# Altium project CAN_CurrentLoopModule.PrjPcb
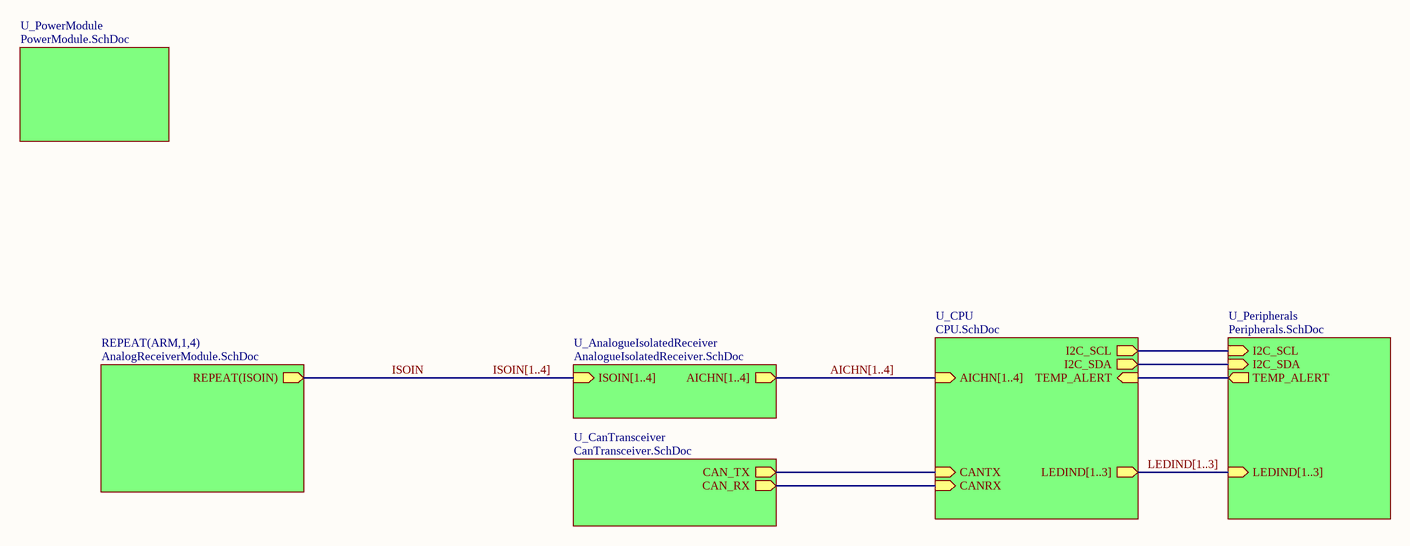
[diagram p0: TopSheet.SchDoc]
Address_Website: pablintino.com; EMail: me@pablintino.com; Project: AIC-ISO-C Module; VersionRevision: 1
7 sheets, 165 parts. Net scope: hierarchical (ports join the sheet entries above them; power ports are global).
Board file: AnalogIO-CAN-HW-Rev1.PcbDoc
Sheets:
  TopSheet.SchDoc
    U_PowerModule = PowerModule.SchDoc
    U_AnalogueIsolatedReceiver = AnalogueIsolatedReceiver.SchDoc
    U_CanTransceiver = CanTransceiver.SchDoc
    U_CPU = CPU.SchDoc
    U_Peripherals = Peripherals.SchDoc
    ARM1 = AnalogReceiverModule.SchDoc
    ARM2 = AnalogReceiverModule.SchDoc
    ARM3 = AnalogReceiverModule.SchDoc
    ARM4 = AnalogReceiverModule.SchDoc

## Sheet TopSheet.SchDoc
size A4

### Sub-sheets
REPEAT(ARM,1,4) = AnalogReceiverModule.SchDoc: REPEAT(ISOIN) (out)
U_AnalogueIsolatedReceiver = AnalogueIsolatedReceiver.SchDoc: ISOIN[1..4] (in), AICHN[1..4] (out)
U_CanTransceiver = CanTransceiver.SchDoc: CAN_RX (out), CAN_TX (out)
U_CPU = CPU.SchDoc: CANTX (in), CANRX (in), AICHN[1..4] (in), I2C_SCL (out), I2C_SDA (out), TEMP_ALERT (in), LEDIND[1..3] (out)
U_Peripherals = Peripherals.SchDoc: I2C_SCL (in), TEMP_ALERT (out), I2C_SDA (in), LEDIND[1..3] (in)
U_PowerModule = PowerModule.SchDoc: no entries

### Nets
CAN_RXD: sheet U_CanTransceiver/CAN_RX, sheet U_CPU/CANRX
CAN_TXD: sheet U_CanTransceiver/CAN_TX, sheet U_CPU/CANTX
I2C_SCL: sheet U_CPU/I2C_SCL, sheet U_Peripherals/I2C_SCL
I2C_SDA: sheet U_CPU/I2C_SDA, sheet U_Peripherals/I2C_SDA
ISOIN: sheet REPEAT(ARM,1,4)/REPEAT(ISOIN)
NetR23_2: sheet U_CPU/TEMP_ALERT, sheet U_Peripherals/TEMP_ALERT

### Buses and harness runs
bus AICHN[1..4] = sheet U_AnalogueIsolatedReceiver/AICHN[1..4] = sheet U_CPU/AICHN[1..4]
bus ISOIN[1..4] = sheet U_AnalogueIsolatedReceiver/ISOIN[1..4]
bus LEDIND[1..3] = sheet U_CPU/LEDIND[1..3] = sheet U_Peripherals/LEDIND[1..3]

### Notes on the sheet
- Title:
- Drawn By:
- Page Contents:
- Checked By:
- Size:
- Date:
- File:
- License:
- Email:
- A4
- Number:
- Time:
- Revision:
- Sheet
- Website:
- of

## Sheet PowerModule.SchDoc: CAN Current Loop Module - Power
size A4; Author: Pablo R Nava; DrawnBy: Pablo R Nava; Engineer: Pablo R Nava
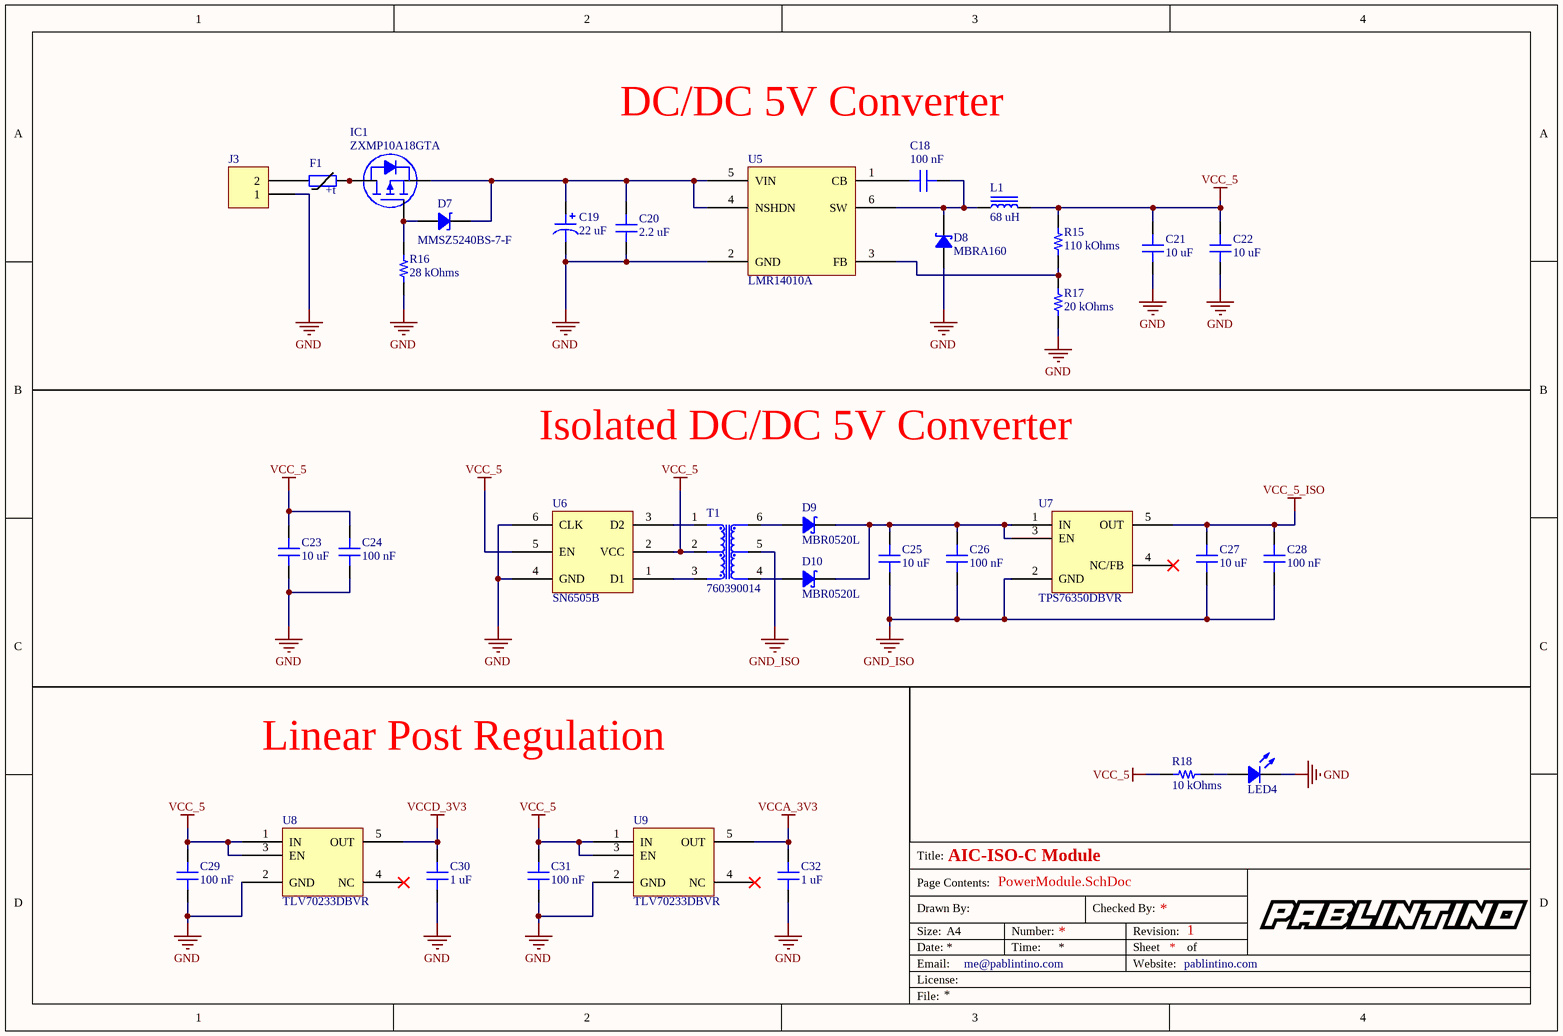
[diagram p1: PowerModule.SchDoc]

### Parts
C18  100 nF  [CAP 0805_2012]
C19  22 uF  [CAP ALSMD 6.3MM H7.7MM]
C20  2.2 uF  [CAP 1206_3216 - 1.8MM]
C21  10 uF  [CAP 1206_3216 - 1.8MM]
C22  10 uF  [CAP 1206_3216 - 1.8MM]
C23  10 uF  [CAP 0805_2012]
C24  100 nF  [CAP 0805_2012]
C25  10 uF  [CAP 0805_2012]
C26  100 nF  [CAP 0805_2012]
C27  10 uF  [CAP 0805_2012]
C28  100 nF  [CAP 0603_1608]
C29  100 nF  [CAP 0603_1608]
C30  1 uF  [CAP 0805_2012]
C31  100 nF  [CAP 0603_1608]
C32  1 uF  [CAP 0805_2012]
D7  MMSZ5240BS-7-F  [SOD-123]
D8  MBRA160  [DO214AC SMA]
D9  MBR0520L  [SOD-123]
D10  MBR0520L  [SOD-123]
F1  NANOASMDC012F-2  [PPTC_1206_1MM]  (value not drawn)
IC1  ZXMP10A18GTA  [DIODES SOT-223]
J3  1757475  [MSTBA2]  (value not drawn)
L1  68 uH  [SRR1210]
LED4  APTD1608LSECK  [LED 0603_1608 RED]  (value not drawn)
R15  110 kOhms  [RES 0805_2012]
R16  28 kOhms  [RES 0805_2012]
R17  20 kOhms  [RES 0805_2012]
R18  10 kOhms  [RES 0603_1608]
T1  760390014  [WE7603900XX]
U5  LMR14010A  [TI SOT-23-6 DDC]
U6  SN6505B  [TI SOT-23-6 DBV]
U7  TPS76350DBVR  [TI SOT-23-5 DBV]
U8  TLV70233DBVR  [TI SOT-23-5 DBV]
U9  TLV70233DBVR  [TI SOT-23-5 DBV]

### Nets
GND: C19.2 C20.2 C21.2 C22.2 C23.2 C24.2 C29.2 C30.2 C31.2 C32.2 D8.1 J3.1 LED4.2 R16.1 R17.2 U5.2(GND) U6.4(GND) U6.6(CLK) U8.2(GND) U9.2(GND)
GND_ISO: C25.2 C26.2 C27.2 C28.2 T1.5 U7.2(GND)
VCC_5: C21.1 C22.1 C23.1 C24.1 C29.1 C31.1 L1.2 R15.1 R18.1 T1.2 U6.2(VCC) U6.5(EN) U8.1(IN) U8.3(EN) U9.1(IN) U9.3(EN)
VCC_5_ISO: C27.1 C28.1 U7.5(OUT)
VCCA_3V3: C32.1 U9.5(OUT)
VCCD_3V3: C30.1 U8.5(OUT)
NetC18_1: C18.1 D8.2 L1.1 U5.6(SW)
NetC18_2: C18.2 U5.1(CB)
NetC19_1: C19.1 C20.1 D7.2 IC1.3(S) U5.4(NSHDN) U5.5(VIN)
NetC25_1: C25.1 C26.1 D9.2 D10.2 U7.1(IN) U7.3(EN)
NetD7_1: D7.1 IC1.1(G) R16.2
NetD9_1: D9.1 T1.6
NetD10_1: D10.1 T1.4
NetF1_1: F1.1 J3.2
NetF1_2: F1.2 IC1.2(D) IC1.4(D)
NetLED4_1: LED4.1 R18.2
NetR15_2: R15.2 R17.1 U5.3(FB)
NetT1_1: T1.1 U6.3(D2)
NetT1_3: T1.3 U6.1(D1)

Not connected (* = marked no-connect by the designer): U7 4(NC/FB)*; U8 4(NC)*; U9 4(NC)*

### Notes on the sheet
- DC/DC 5V Converter
- Isolated DC/DC 5V Converter
- Linear Post Regulation
- Title:
- Drawn By:
- Page Contents:
- Checked By:
- Size:
- Date:
- File:
- License:
- Email:
- A4
- Number:
- Time:
- Revision:
- Sheet
- Website:
- of
- (in symbol NANOASMDC012F-2) +t

### Library data of the parts
C18 = 08055C104K4Z2A: MLCC Ceramic 100 nF 50 V 10% Capacitor; Manufacturer: AVX; Voltage: 50 V; Type: capacitor_ceramic; Through Hole: 0; Part Number: 08055C104K4Z2A; Value: 100 nF; Tolerance: 10%; Composition: X7R; Created On: 30/05/2020 9:36:24; Updated On: 30/05/2020 9:36:39; Package: 0805 (2012 Metric)
C19 = HHXA630ARA220MF80G: Aluminum Electrolytic 22 uF 63 V 20% Capacitor; Manufacturer: United Chemi-Con; Voltage: 63 V; Material: aluminium; Polarised: 1; ESR: 80 mOhms; Lifetime Temperature: 4000 Hours @ 125 ºC; Minimum Temperature: 125 ºC; Maximum Temperature: -55 ºC; Type: capacitor_electrolytic; Through Hole: 0; Part Number: HHXA630ARA220MF80G; Value: 22 uF; Tolerance: 20%; Created On: 03/08/2020 11:19:58; Updated On: 03/08/2020 14:04:34; Package: SMD
C20 = 12065C225K4T2A: MLCC Ceramic 2.2 uF 50 V 10% Capacitor; Manufacturer: AVX; Voltage: 50 V; Type: capacitor_ceramic; Through Hole: 0; Part Number: 12065C225K4T2A; Value: 2.2 uF; Tolerance: 10%; Composition: X7R; Created On: 18/08/2020 12:44:20; Updated On: 18/08/2020 12:44:32; Package: 1206 (3216 Metric)
C21 C22 = 1206YC106KAT2A: MLCC Ceramic 10 uF 16 V 10% Capacitor; Manufacturer: AVX; Voltage: 16 V; Type: capacitor_ceramic; Through Hole: 0; Part Number: 1206YC106KAT2A; Value: 10 uF; Tolerance: 10%; Composition: X7R; Created On: 18/08/2020 12:31:56; Updated On: 18/08/2020 12:32:34; Package: 1206 (3216 Metric)
C23 C25 C27 = 0805YC106MAT2A: MLCC Ceramic 10 uF 25 V 20% Capacitor; Manufacturer: AVX; Voltage: 16 V; Type: capacitor_ceramic; Through Hole: 0; Part Number: 0805YC106MAT2A; Value: 10 uF; Tolerance: 20%; Composition: X7R; Created On: 22/06/2020 21:37:18; Updated On: 22/06/2020 21:37:31; Package: 0805 (2012 Metric)
C24 C26 = 0805YC104KAT4A: MLCC Ceramic 100 nF 16 v 10% Capacitor; Manufacturer: AVX; Voltage: 16 V; Type: capacitor_ceramic; Through Hole: 0; Part Number: 0805YC104KAT4A; Value: 100 nF; Tolerance: 10%; Composition: X7R; Created On: 21/05/2020 21:26:42; Updated On: 21/05/2020 21:29:08; Package: 0805 (2012 Metric)
C28 C29 C31 = 0603YC104KAT2A: MLCC Ceramic 100 nF 16 V 10% Capacitor; Manufacturer: AVX; Voltage: 16 V; Type: capacitor_ceramic; Through Hole: 0; Part Number: 0603YC104KAT2A; Value: 100 nF; Tolerance: 10%; Composition: X7R; Created On: 22/07/2020 19:09:12; Updated On: 22/07/2020 19:10:15; Package: 0603 (1608 Metric)
C30 C32 = 0805YC105KAT4A: MLCC Ceramic 1 uF 16 V 10% Capacitor; Manufacturer: AVX; Voltage: 16 V; Type: capacitor_ceramic; Through Hole: 0; Part Number: 0805YC105KAT4A; Value: 1 uF; Tolerance: 10%; Composition: X7R; Created On: 18/07/2020 20:46:26; Updated On: 18/07/2020 20:46:47; Package: 0805 (2012 Metric)
D7 = MMSZ5240BS-7-F: Zener 200 mW 10 V; Manufacturer: Diodes Incorporated; Maximum Power: 200 mW; Forward Voltage: 0.9 V; Zener Voltage: 10 V; Type: diode_zener; Through Hole: 0; Part Number: MMSZ5240BS-7-F; Created On: 19/07/2020 12:49:44; Updated On: 19/07/2020 13:00:21; Package: SOD-323-2
D8 = MBRA160: Schottky Rectifier Diode; Manufacturer: ON Semiconductor; Forward Voltage: 0.510 V; Reverse Leakage Current: 0.2 mA; Maximum Forward Avg. Current: 1 A; Maximum Repetitive Reverse Voltage: 60 V; Type: diode_rectifier; Through Hole: 0; Part Number: MBRA160; Diode Type: schottky; Created On: 02/08/2020 21:52:05; Updated On: 02/08/2020 21:57:57; Package: SMA 403D
D9 D10 = MBR0520L: Schottky Rectifier Diode; Manufacturer: ON Semiconductor; Forward Voltage: 0.385 V; Reverse Leakage Current: 8 mA; Maximum Forward Avg. Current: 500 mA; Maximum Repetitive Reverse Voltage: 20 V; Type: diode_rectifier; Through Hole: 0; Part Number: MBR0520L; Diode Type: schottky; Created On: 02/08/2020 21:34:39; Updated On: 02/08/2020 21:35:15; Package: SOD-123
F1 = NANOASMDC012F-2: PPTC .12A 48V Nano SMD AEC-Q200; Manufacturer: Littelfuse; Hold Current: 120 mA; Trip Current: 390 mA; Maximum Resistance: 1.5 Ohms; Minimum Resistance: 6.5 Ohms; Power Rating: 500 mW; Current Rating: 10 A; Type: fuse_pptc; Through Hole: 0; Part Number: NANOASMDC012F-2; Voltage Rating: 48 V; Created On: 07/08/2020 10:13:16; Updated On: 18/08/2020 22:26:58; Package: 1206 (3216 Metric)
IC1 = ZXMP10A18GTA: MOSFET 100V P-Chnl UMOS; Manufacturer: Diodes Incorporated; Drain Source Resistance: 150 mOhms; Gate Source Max Voltage: 20 V; Gate Source Threshold Voltage: 2 V; Drain Source Max Current: 3.7 A; Maximum Power: 3.9 W; Channel Type: P-Channel; Through Hole: 0; Part Number: ZXMP10A18GTA; Drain Source Max Voltage: 100 V; Created On: 19/07/2020 8:37:51; Updated On: 19/07/2020 11:20:23; Type: transistor_mosfet; Package: SOT-223-4
J3 = 1757475: Pluggable Terminal Blocks 2 Pos 5mm pitch Through Hole Header; Manufacturer: Phoenix Contact; Voltage Rating: 250 V; Current Rating: 12 A; Number of Contacts: 2; Through Hole: 1; LatestRevisionDate: 17-Jul-2002; LatestRevisionNote: Re-released for DXP Platform.; Publisher: Altium Limited; Part Number: 1757475; Orientation: right; Pitch: 5 mm; Number of Rows: 1; Created On: 18/07/2020 15:45:14; Updated On: 18/07/2020 15:45:51; Type: connector_pcb; Package: Through Hole
L1 = SRR1210-680M: Shielded SMD Power Inductor 68 uH 3 A; Manufacturer: Bourns; Resistance DCR: 102 mOhms; Test Frequency: 2.52 MHz; Current Rating: 3 A; Current Saturation: 2.7 A; Tolerance: 20%; Type: power_inductor; Through Hole: 0; Part Number: SRR1210-680M; Value: 68 uH; Created On: 02/08/2020 17:46:05; Updated On: 02/08/2020 21:10:00; Package: SRR1210
LED4 = APTD1608LSECK: SMD Low Current Red LED; Manufacturer: Kingbright; Gain Bandwith Product: 1.8 V; Input Type: dome; Amplifier Type: clear; Slew Rate: 625 nm; Voltage Supplies: 2 mA; Input Offset Voltage: 0.8 mm x 1.2 mm; Type: led_indicator; Through Hole: 0; Part Number: APTD1608LSECK; Output Type: red; Created On: 28/07/2020 18:43:03; Updated On: 28/07/2020 18:43:38; Package: 0603 (1608 Metric)
R15 = CRCW0805110KFKEAC: Thin Film Resistor 110 kOhms 1%; Manufacturer: Vishay / Dale; Power Max: 125 mW; Through Hole: 0; Part Number: CRCW0805110KFKEAC; Value: 110 kOhms; Tolerance: 1%; Created On: 18/08/2020 11:17:49; Updated On: 18/08/2020 11:18:12; Type: resistor; Package: 0805 (2012 Metric)
R16 = CRCW080528K0FKEA: Thin Film Resistor 28 kOhms 1%; Manufacturer: Vishay / Dale; Power Max: 125 mW; Through Hole: 0; Part Number: CRCW080528K0FKEA; Value: 28 kOhms; Tolerance: 1%; Created On: 19/07/2020 13:06:42; Updated On: 19/07/2020 13:07:02; Type: resistor; Package: 0805 (2012 Metric)
R17 = CRCW080520K0FKEAC: Thin Film Resistor 20 kOhms 1%; Manufacturer: Vishay / Dale; Power Max: 125 mW; Through Hole: 0; Part Number: CRCW080520K0FKEAC; Value: 20 kOhms; Tolerance: 1%; Created On: 18/08/2020 11:20:59; Updated On: 18/08/2020 11:21:05; Type: resistor; Package: 0805 (2012 Metric)
R18 = CRCW060310K0FKEAC: Thin Film Resistor 10 kOhms 1%; Manufacturer: Vishay / Dale; Power Max: 100 mW; Through Hole: 0; Part Number: CRCW060310K0FKEAC; Value: 10 kOhms; Tolerance: 1%; Created On: 22/07/2020 22:08:22; Updated On: 22/07/2020 22:09:01; Type: resistor; Package: 0603 (1608 Metric)
T1 = 760390014: MID-PPTI Push-Pull Transformer for TI SN650X; Manufacturer: Würth Elektronik; Number of Windings: 2; Primary DCR: 0.31 Ohms; Secondary DCR: 0.37 Ohms; Primary Inductance: 475 uH; Secondary Current Rating: 0.35 A; Primary Voltage Rating: 5 V; NPS Turns Ratio: 1:1.3; Through Hole: 0; Part Number: 760390014; Secondary Voltage Rating: 5 V; Created On: 18/08/2020 10:06:14; Updated On: 18/08/2020 10:09:43; Type: transformer; Package: 76039XXXX; Minimum Operating Temperature: -40 ªC; Maximum Operating Temperature: 125 ªC
U5 = LMR14010A: 4-V to 40-V, 1-A Step-Down Converter With High Efficiency Eco-mode; Manufacturer: Texas Instruments; Minimum Input Voltage: 4 V; Maximum Output Voltage: 40 V; Output Current: 1 A; Switching Frequency: 700 kHz; Topology: buck; Output Type: TBD; Number of Outputs: 1; Through Hole: 0; Part Number: LMR14010A; Created On: 02/08/2020 17:31:43; Updated On: 02/08/2020 21:12:40; Type: voltage_regulator_dcdc; Package: SOT-23-6
U6 = SN6505B: Low-Noise 1-A Transformer Drivers for Isolated Power Supplies; Manufacturer: Texas Instruments; Minimum Input Voltage: 3 V; Maximum Output Voltage: 5.5 V; Output Current: 1 A; Switching Frequency: 420 kHz; Topology: push-pull; Output Type: TBD; Number of Outputs: 1; Through Hole: 0; Part Number: SN6505B; Created On: 02/08/2020 17:34:18; Updated On: 02/08/2020 21:12:17; Type: voltage_regulator_dcdc; Package: SOT-23-6
U7 = TPS76350DBVR: Low-Power, 150-mA, Low-Dropout Linear Regulator; Manufacturer: Texas Instruments; Minimum/Fixed Output Voltage: 5 V; Output Current: 150 mA; Maximum Supply Current: 100 uA; Maximum Dropout Voltage: 225 mV; PSSR: 60 dB @ 1 kHz; Output Type: fixed; Through Hole: 0; Part Number: TPS76350DBVR; Maximum Output Voltage: 5 V; Created On: 02/08/2020 22:14:03; Updated On: 02/08/2020 22:19:56; Type: voltage_regulator_linear; Package: SOT-23-5
U8 U9 = TLV70233DBVR: TLV702 300-mA, Low-IQ, Low-Dropout Regulator; Manufacturer: Texas Instruments; Minimum/Fixed Output Voltage: 3.3 V; Output Current: 300 mA; Maximum Supply Current: 35 uA; Maximum Dropout Voltage: 375 mV; PSSR: 68 dB @ 1 kHz; Output Type: fixed; Through Hole: 0; Part Number: TLV70233DBVR; Maximum Output Voltage: 3.3 V; Created On: 21/07/2020 22:25:25; Updated On: 21/07/2020 22:25:46; Type: voltage_regulator_linear; Package: SOT-23-5

## Sheet AnalogueIsolatedReceiver.SchDoc
size A4; Author: Pablo R Nava; DrawnBy: Pablo R Nava; Engineer: Pablo R Nava
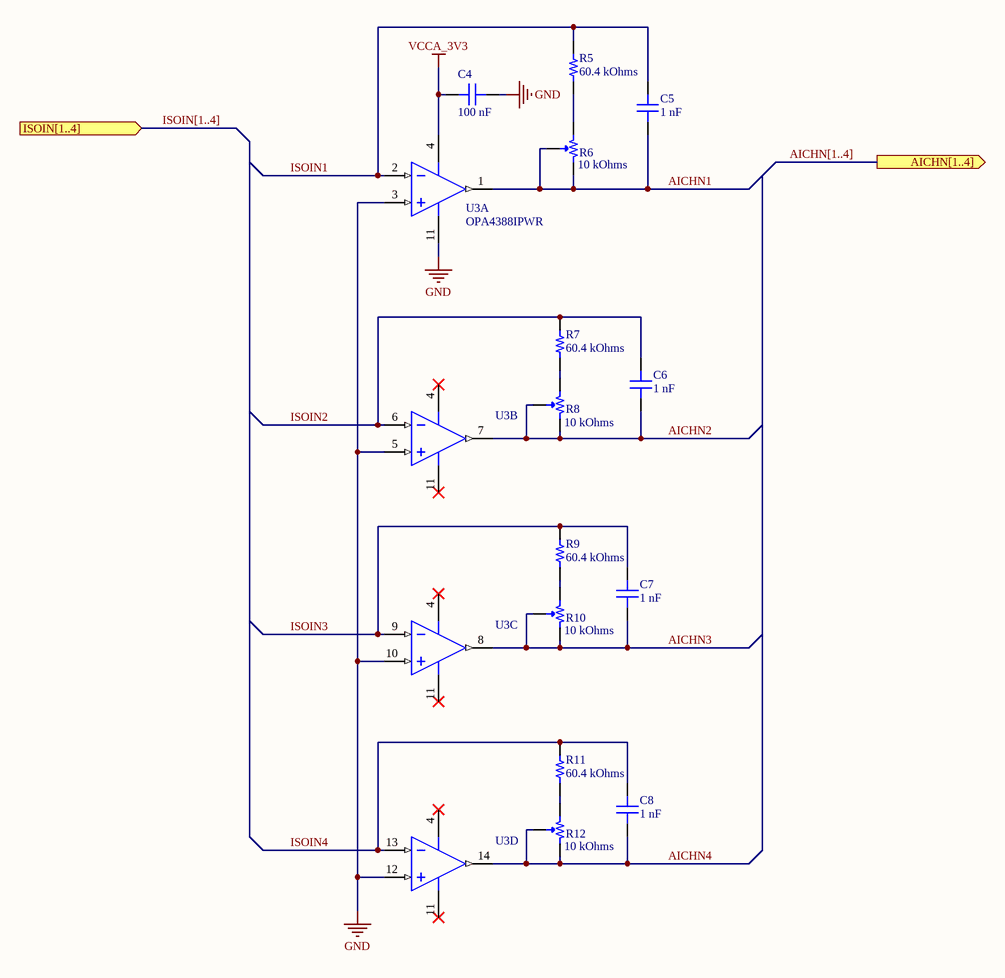
[diagram p2: AnalogueIsolatedReceiver.SchDoc]

### Parts
C4  100 nF  [CAP 0603_1608]
C5  1 nF  [CAP 0603_1608]
C6  1 nF  [CAP 0603_1608]
C7  1 nF  [CAP 0603_1608]
C8  1 nF  [CAP 0603_1608]
R5  60.4 kOhms  [RES 0603_1608]
R6  10 kOhms  [POT BOURNS TRIMPOT 3224W]
R7  60.4 kOhms  [RES 0603_1608]
R8  10 kOhms  [POT BOURNS TRIMPOT 3224W]
R9  60.4 kOhms  [RES 0603_1608]
R10  10 kOhms  [POT BOURNS TRIMPOT 3224W]
R11  60.4 kOhms  [RES 0603_1608]
R12  10 kOhms  [POT BOURNS TRIMPOT 3224W]
U3  OPA4388IPWR  [TI TSSOP-14 PW]  (parts A,B,C,D of 4)

### Ports
AICHN[1..4] (out), ISOIN[1..4] (in)

### Nets
GND: C4.1 U3.3(IN1+) U3.5(IN2+) U3.10(IN3+) U3.11(GND) U3.12(IN4+)
VCCA_3V3: C4.2 U3.4(VDD)
AICHN1: C5.2 R6.2 R6.3 U3.1(OUT1)
AICHN2: C6.2 R8.2 R8.3 U3.7(OUT2)
AICHN3: C7.2 R10.2 R10.3 U3.8(OUT3)
AICHN4: C8.2 R12.2 R12.3 U3.14(OUT4)
ISOIN1: C5.1 R5.2 U3.2(IN1-)  [project net ISOIN]
ISOIN2: C6.1 R7.2 U3.6(IN2-)  [project net ISOIN]
ISOIN3: C7.1 R9.2 U3.9(IN3-)  [project net ISOIN]
ISOIN4: C8.1 R11.2 U3.13(IN4-)  [project net ISOIN]
NetR5_1: R5.1 R6.1
NetR7_1: R7.1 R8.1
NetR9_1: R9.1 R10.1
NetR11_1: R11.1 R12.1

### Buses and harness runs
bus AICHN[1..4] = port AICHN[1..4]
bus ISOIN[1..4] = port ISOIN[1..4]

### Notes on the sheet
- Title:
- Drawn By:
- Page Contents:
- Checked By:
- Size:
- Date:
- File:
- License:
- Email:
- A4
- Number:
- Time:
- Revision:
- Sheet
- Website:
- of

### Library data of the parts
C4 = 0603YC104KAT2A: as C28 on sheet PowerModule; Part Number: 0603YC104KAT2A; Value: 100 nF; Tolerance: 10%; Composition: X7R; Created On: 22/07/2020 19:09:12; Updated On: 22/07/2020 19:10:15; Package: 0603 (1608 Metric)
C5-C8 = 0603ZA102JAT4A: MLCC Ceramic 1 nF 10 V 5% Capacitor; Manufacturer: AVX; Voltage: 10 V; Type: capacitor_ceramic; Through Hole: 0; Part Number: 0603ZA102JAT4A; Value: 1 nF; Tolerance: 5%; Composition: NP0; Created On: 04/08/2020 17:52:12; Updated On: 04/08/2020 17:52:29; Package: 0603 (1608 Metric)
R5 R7 R9 R11 =  CRCW060360K4FKEA: Thin Film Resistor 60.4 kOhms 1%; Manufacturer: Vishay / Dale; Power Max: 100 mW; Through Hole: 0; Part Number: CRCW060360K4FKEA; Value: 60.4 kOhms; Tolerance: 1%; Created On: 17/09/2020 21:59:57; Updated On: 17/09/2020 22:00:30; Type: resistor; Package: 0603 (1608 Metric)
R6 R8 R10 R12 = 3224W-1-103G: Inline Multitourn 10 kOhms 10% potentiometer; Manufacturer: Bourns; Maximum Power: 250 mW; Minimum Resistance: 0 Ohms; Number of Turns: 12; Through Hole: 0; Part Number: 3224W-1-103G; Value: 10 kOhms; Tolerance: 10%; Maximum Resistance: 10 kOhms; Created On: 04/08/2020 17:43:15; Updated On: 04/08/2020 17:43:43; Type: potentiometer; Package: 3224W
U3 = OPA4388IPWR: OPA4388 Zero-Drift, Zero-Crossover, Low Offset, Precision Rail-to-Rail I/O Opamp; Manufacturer: Texas Instruments; Gain Bandwith Product: 10 MHz; Slew Rate: 5 V/us; Voltage Supplies: ±1.25 V to ±2.75 V; Input Offset Voltage: 0.25 uV; Output Current: ±30 mA; Through Hole: 0; Part Number: OPA4388IPWR; Output Type: Rail-to-Rail; Input Type: Rail-to-Rail; Amplifier Type: precision; Created On: 19/08/2020 23:51:30; Updated On: 19/08/2020 23:56:10; Type: opamp; Package: TSSOP-14

## Sheet CanTransceiver.SchDoc
size A4; Author: Pablo R Nava; DrawnBy: Pablo R Nava; Engineer: Pablo R Nava
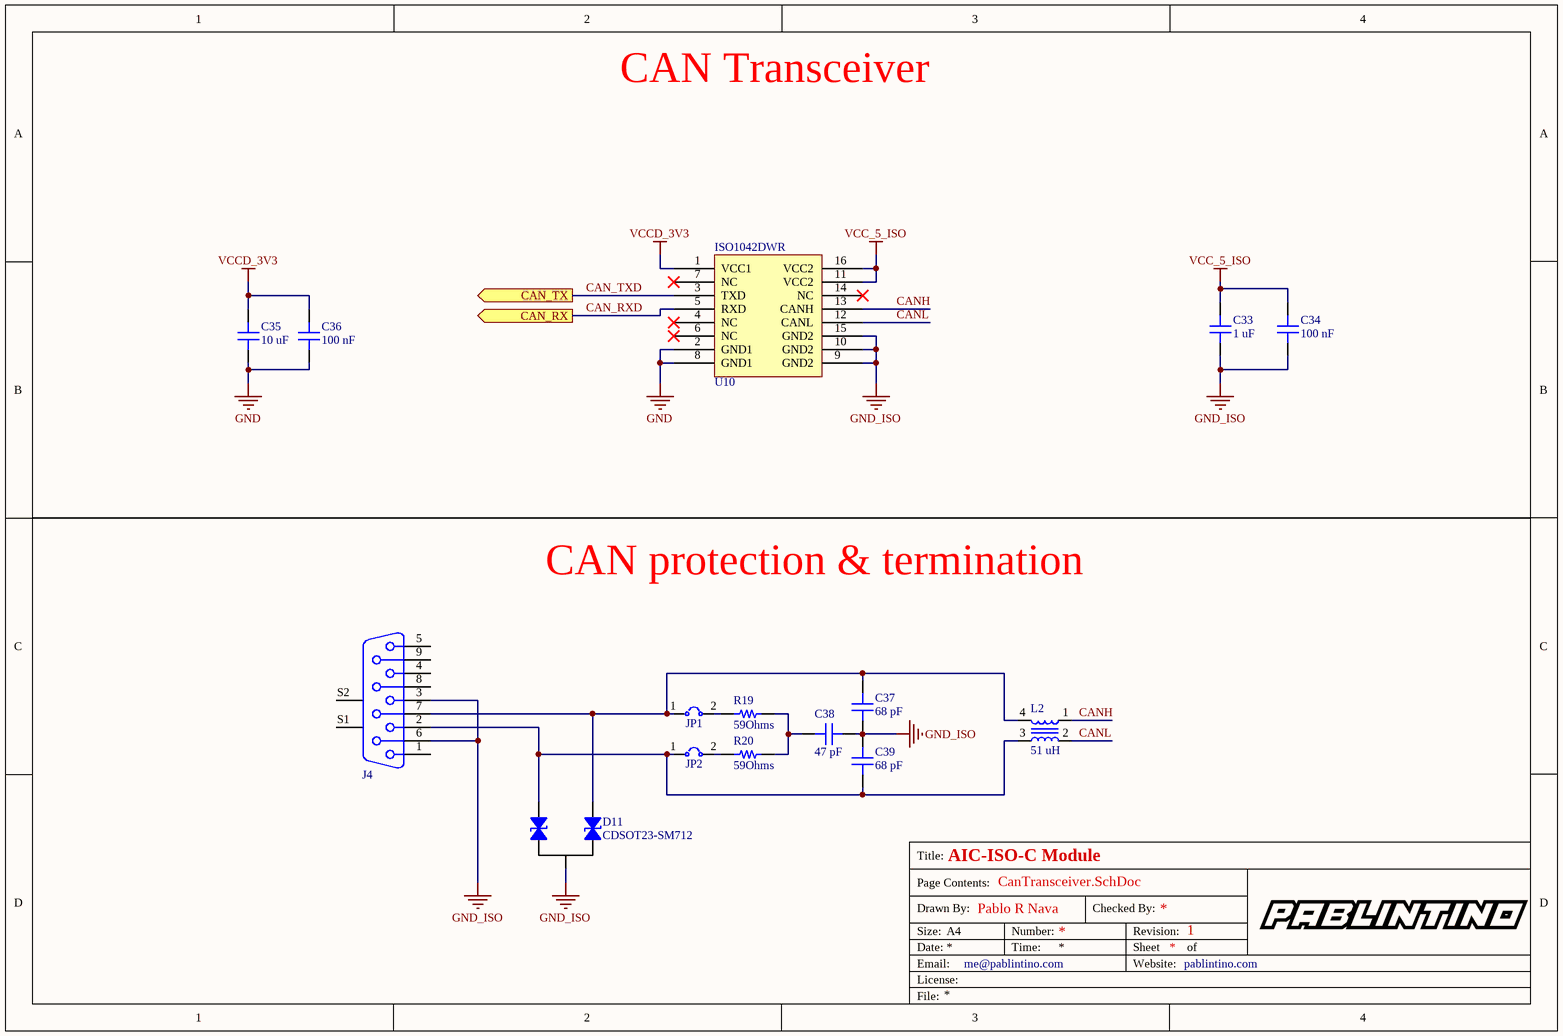
[diagram p3: CanTransceiver.SchDoc]

### Parts
C33  1 uF  [CAP 0603_1608]
C34  100 nF  [CAP 0603_1608]
C35  10 uF  [CAP 0805_2012]
C36  100 nF  [CAP 0603_1608]
C37  68 pF  [CAP 0603_1608]
C38  47 pF  [CAP 0603_1608]
C39  68 pF  [CAP 0603_1608]
D11  CDSOT23-SM712  [BOURNS SOT-23-3]
J4  09681537613  [DSUB9]  (value not drawn)
JP1  61300211121  [JUMPER-100]  (value not drawn)
JP2  61300211121  [JUMPER-100]  (value not drawn)
L2  51 uH  [TDK_ACT45B]
R19  59Ohms  [RES 1206_3216]
R20  59Ohms  [RES 1206_3216]
U10  ISO1042DWR  [TI-DW16_N]

### Ports
CAN_RX (out), CAN_TX (out)

### Nets
GND: C35.2 C36.2 U10.2(GND1) U10.8(GND1)
GND_ISO: C33.1 C34.2 C37.2 C38.1 C39.1 D11.3 J4.3 J4.6 U10.9(GND2) U10.10(GND2) U10.15(GND2)
VCC_5_ISO: C33.2 C34.1 U10.11(VCC2) U10.16(VCC2)
VCCD_3V3: C35.1 C36.1 U10.1(VCC1)
CAN_RXD: U10.5(RXD) ; port CAN_RX
CAN_TXD: U10.3(TXD) ; port CAN_TX
CANH: L2.1 U10.13(CANH)
CANL: L2.2 U10.12(CANL)
NetC37_1: C37.1 D11.2 J4.7 JP1.1(A) L2.4
NetC38_2: C38.2 R19.1 R20.1
NetC39_2: C39.2 D11.1 J4.2 JP2.1(A) L2.3
NetJP1_2: JP1.2(K) R19.2
NetJP2_2: JP2.2(K) R20.2

Not connected (* = marked no-connect by the designer): J4 1 4 5 8 9 S1 S2; U10 4(NC)* 6(NC)* 7(NC)* 14(NC)*

### Notes on the sheet
- CAN Transceiver
- CAN protection & termination
- Title:
- Drawn By:
- Page Contents:
- Checked By:
- Size:
- Date:
- File:
- License:
- Email:
- A4
- Number:
- Time:
- Revision:
- Sheet
- Website:
- of

### Library data of the parts
C33 = 06033C105KAT4A: MLCC Ceramic 1 uF 25 V 10% Capacitor; Manufacturer: AVX; Voltage: 25 V; Type: capacitor_ceramic; Through Hole: 0; Part Number: 06033C105KAT4A; Value: 1 uF; Tolerance: 10%; Composition: X7R; Created On: 22/06/2020 21:33:54; Updated On: 22/06/2020 21:34:12; Package: 0603 (1608 Metric)
C34 = 0603YC104KAT2A: as C28 on sheet PowerModule; Part Number: 0603YC104KAT2A; Value: 100 nF; Tolerance: 10%; Composition: X7R; Created On: 22/07/2020 19:09:12; Updated On: 22/07/2020 19:10:15; Package: 0603 (1608 Metric)
C35 = 0805YC106MAT2A: as C23 on sheet PowerModule; Part Number: 0805YC106MAT2A; Value: 10 uF; Tolerance: 20%; Composition: X7R; Created On: 22/06/2020 21:37:18; Updated On: 22/06/2020 21:37:31; Package: 0805 (2012 Metric)
C36 = 06035C104K4Z2A: MLCC Ceramic 100 nF 50 V 10% Capacitor; Manufacturer: AVX; Voltage: 50 V; Type: capacitor_ceramic; Through Hole: 0; Part Number: 06035C104K4Z2A; Value: 100 nF; Tolerance: 10%; Composition: X7R; Created On: 22/06/2020 21:28:51; Updated On: 22/06/2020 21:29:02; Package: 0603 (1608 Metric)
C37 C39 = 06031A680FAT2A: MLCC Ceramic 68 pF 100 V 1% Capacitor; Manufacturer: AVX; Voltage: 100 V; Type: capacitor_ceramic; Through Hole: 0; Part Number: 06031A680FAT2A; Value: 68 pF; Tolerance: 1%; Composition: NP0; Created On: 04/08/2020 0:35:07; Updated On: 04/08/2020 0:35:13; Package: 0603 (1608 Metric)
C38 = 06031U470FAT2A: MLCC Ceramic 47 pF 100 V 1% Capacitor; Manufacturer: AVX; Voltage: 100 V; Type: capacitor_ceramic; Through Hole: 0; Part Number: 06031U470FAT2A; Value: 47 pF; Tolerance: 1%; Composition: NP0; Created On: 04/08/2020 0:33:07; Updated On: 04/08/2020 0:33:40; Package: 0603 (1608 Metric)
D11 = CDSOT23-SM712: CAN bus TVS diode; Manufacturer: Bourns; Standoff Reverse Voltage: 13.3 V; Minimum Breakdown Voltage: 12 V; Maximum Clamping Voltage: 26 V; Type: diode_tvs; Through Hole: 0; Part Number: CDSOT23-SM712; Created On: 22/06/2020 21:57:13; Updated On: 22/06/2020 21:57:43; Package: SOT-23
J4 = 09681537613: DSUB SV FE SSDP ANG-US 09P AU3; Manufacturer: Harting; Pitch: 2.77 mm; Current Rating: 6 A; Number of Contacts: 9; Through Hole: 1; Part Number: 09681537613; Orientation: right; Number of Rows: 2; Created On: 18/07/2020 11:53:48; Updated On: 18/07/2020 11:54:47; Type: connector_pcb; Package: Through Hole
JP1 JP2 = 61300211121: Connector Header Through Hole 2 position 0.100 (2.54mm); Manufacturer: Würth Elektronik; Pitch: 100 mil; Voltage Rating: 250 V; Current Rating: 3 A; Number of Contacts: 2; Through Hole: 1; Part Number: 61300211121; Orientation: straight; Number of Rows: 1; Created On: 19/07/2020 13:40:52; Updated On: 19/07/2020 13:41:17; Type: connector_pcb; Package: Through Hole
L2 = ACT45B-510-2P-TL003: CAN Bus Common Choke; Manufacturer: TDK; Number of Lines: 2; DC Resistance: 1 Ohms; Impedance Frequency: 2800 Ohms @ 10 MHz; Current Rating: 200 mA; Type: inductor_choke; Through Hole: 0; Part Number: ACT45B-510-2P-TL003; Value: 51 uH; Created On: 23/06/2020 19:40:24; Updated On: 23/06/2020 20:05:36; Package: ACT45B
R19 R20 = CRCW120659R0FKEA: Thin Film Resistor 59 Ohms 1%; Manufacturer: Vishay / Dale; Power Max: 250 mW; Through Hole: 0; Part Number: CRCW120659R0FKEA; Value: 59Ohms; Tolerance: 1%; Created On: 04/08/2020 0:42:53; Updated On: 04/08/2020 0:43:02; Type: resistor; Package: 1206 (3216 Metric)
U10 = ISO1042DWR: Isolated CAN FD Transceiver; Manufacturer: Texas Instruments; Duplex: Full-Duplex; Data Rate: 5Mbps; Supply Voltage: 5 V; Through Hole: 0; Part Number: ISO1042DWR; Protocol: CAN; Created On: 22/06/2020 19:10:03; Updated On: 22/06/2020 19:54:36; Type: transceiver; Package: SOIC-16

## Sheet CPU.SchDoc
size A4
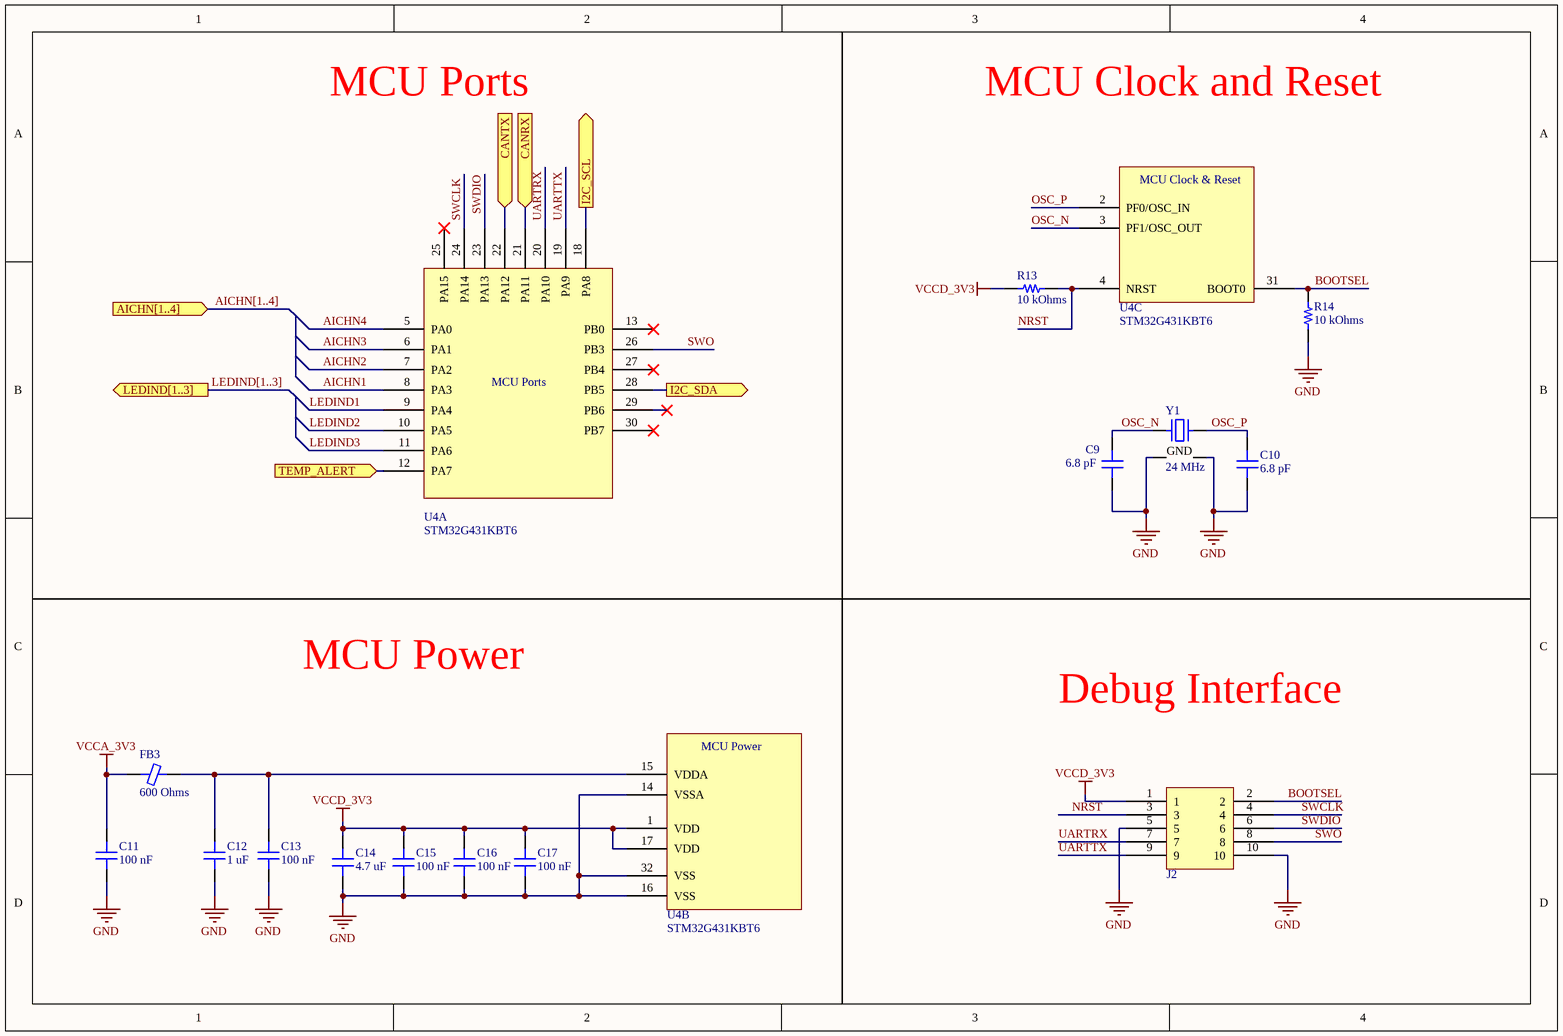
[diagram p4: CPU.SchDoc]

### Parts
C9  6.8 pF  [CAP 0603_1608]
C10  6.8 pF  [CAP 0603_1608]
C11  100 nF  [CAP 0603_1608]
C12  1 uF  [CAP 0603_1608]
C13  100 nF  [CAP 0603_1608]
C14  4.7 uF  [CAP 0603_1608]
C15  100 nF  [CAP 0603_1608]
C16  100 nF  [CAP 0603_1608]
C17  100 nF  [CAP 0603_1608]
FB3  600 Ohms  [FER 0805_2012]
J2  SHF-105-01-L-D-TH  [SHF-105-01-X-D-TH]  (value not drawn)
R13  10 kOhms  [RES 0603_1608]
R14  10 kOhms  [RES 0603_1608]
U4  STM32G431KBT6  [LQFP32ST]  (parts A,B,C of 3)
Y1  24 MHz  [ABM8G]

### Ports
AICHN[1..4] (in), CANRX (in), CANTX (in), I2C_SCL (out), I2C_SDA (out), LEDIND[1..3] (out), TEMP_ALERT (in)

### Nets
GND: C9.2 C10.2 C11.2 C12.1 C13.2 C14.1 C15.2 C16.2 C17.2 J2.5 J2.10 R14.2 U4.14(VSSA) U4.16(VSS) U4.32(VSS) Y1.2(GND) Y1.4(GND)
VCCA_3V3: C11.1 FB3.2
VCCD_3V3: C14.2 C15.1 C16.1 C17.1 J2.1 R13.1 U4.1(VDD) U4.17(VDD)
AICHN1: U4.8(PA3)
AICHN2: U4.7(PA2)
AICHN3: U4.6(PA1)
AICHN4: U4.5(PA0)
BOOTSEL: J2.2 R14.1 U4.31(BOOT0)
CAN_RXD: U4.21(PA11) ; port CANRX
CAN_TXD: U4.22(PA12) ; port CANTX
I2C_SCL: U4.18(PA8) ; port I2C_SCL
I2C_SDA: U4.28(PB5) ; port I2C_SDA
LEDIND1: U4.9(PA4)
LEDIND2: U4.10(PA5)
LEDIND3: U4.11(PA6)
NRST: J2.3 R13.2 U4.4(NRST)
OSC_N: C9.1 U4.3(PF1/OSC_OUT) Y1.1
OSC_P: C10.1 U4.2(PF0/OSC_IN) Y1.3
SWCLK: J2.4 U4.24(PA14)
SWDIO: J2.6 U4.23(PA13)
SWO: J2.8 U4.26(PB3)
UARTRX: J2.7 U4.20(PA10)
UARTTX: J2.9 U4.19(PA9)
NetC12_2: C12.2 C13.1 FB3.1 U4.15(VDDA)
NetR23_2: U4.12(PA7) ; port TEMP_ALERT

Not connected (* = marked no-connect by the designer): U4 13(PB0)* 25(PA15)* 27(PB4)* 29(PB6)* 30(PB7)*

### Buses and harness runs
bus AICHN[1..4] = port AICHN[1..4]
bus LEDIND[1..3] = port LEDIND[1..3]

### Notes on the sheet
- MCU Ports
- MCU Clock and Reset
- MCU Power
- Debug Interface
- Title:
- Drawn By:
- Page Contents:
- Checked By:
- Size:
- Date:
- File:
- License:
- Email:
- A4
- Number:
- Time:
- Revision:
- Sheet
- Website:
- of
- (in symbol STM32G431KBT6, part A) MCU Ports
- (in symbol STM32G431KBT6, part B) MCU Power
- (in symbol STM32G431KBT6, part C) MCU Clock & Reset

### Library data of the parts
C9 C10 = 06035A6R8C4T4A: MLCC Ceramic 6.8 pF 50 V 0.25 pF Capacitor; Manufacturer: AVX; Tolerance: 0.25 pF; Voltage: 50 V; Type: capacitor_ceramic; Through Hole: 0; Part Number: 06035A6R8C4T4A; Value: 6.8 pF; Composition: NP0; Created On: 26/07/2020 23:31:19; Updated On: 26/07/2020 23:32:14; Package: 0603 (1608 Metric)
C11 C13 C15-C17 = 0603YC104KAT2A: as C28 on sheet PowerModule; Part Number: 0603YC104KAT2A; Value: 100 nF; Tolerance: 10%; Composition: X7R; Created On: 22/07/2020 19:09:12; Updated On: 22/07/2020 19:10:15; Package: 0603 (1608 Metric)
C12 = 0603YC105KAT2A: MLCC Ceramic 1 uF 16 V 10% Capacitor; Manufacturer: AVX; Voltage: 16 V; Type: capacitor_ceramic; Through Hole: 0; Part Number: 0603YC105KAT2A; Value: 1 uF; Tolerance: 10%; Composition: X7R; Created On: 26/07/2020 17:38:43; Updated On: 26/07/2020 17:39:03; Package: 0603 (1608 Metric)
C14 = GRM188Z71A475ME15D: MLCC Ceramic 4.7 uF 10 V 20% Capacitor; Manufacturer: Murata; Voltage: 10 V; Type: capacitor_ceramic; Through Hole: 0; Part Number: GRM188Z71A475ME15D; Value: 4.7 uF; Tolerance: 20%; Composition: X7R; Created On: 26/07/2020 16:11:28; Updated On: 26/07/2020 16:12:07; Package: 0603 (1608 Metric)
FB3 = BLM21SP601SH1D: Ferrite bead; Manufacturer: Murata Electronics; Number of Lines: 1; DC Resistance: 60 mOhms; Impedance Frequency: 600 Ohms @ 100 MHz; Current Rating: 1.5 A; Type: ferrite_bead; Through Hole: 0; Part Number: BLM21SP601SH1D; Value: 600 Ohms; Created On: 16/05/2020 11:32:40; Updated On: 16/05/2020 17:15:58; Package: 0805 (2012 Metric)
J2 = SHF-105-01-L-D-TH: Shrouded Terminal Strip, 0.050 pitch; Manufacturer: Samtec; Pitch: 50 mil; Voltage Rating: 300 V; Current Rating: 1 A; Number of Contacts: 10; Through Hole: 1; Part Number: SHF-105-01-L-D-TH; Orientation: straight; Number of Rows: 2; Created On: 31/05/2020 10:51:13; Updated On: 31/05/2020 10:51:32; Type: connector_pcb; Package: Through Hole
R13 R14 = CRCW060310K0FKEAC: as R18 on sheet PowerModule; Part Number: CRCW060310K0FKEAC; Value: 10 kOhms; Tolerance: 1%; Created On: 22/07/2020 22:08:22; Updated On: 22/07/2020 22:09:01; Type: resistor; Package: 0603 (1608 Metric)
U4 = STM32G431KBT6: STM32G431 ARM Cortex-M4  170MHz MCU; Manufacturer: STMicroelectronics; Core Size: 32 bits; Flash Size: 128 kB; RAM Size: 32 kB; Peripherals: ADC, DAC, Comparator, PGA, Temp, Timers; Connectivity: SPI, I2C, USART, USB, CAN, I2S; Voltage Supply: 3.3 V; Through Hole: 0; Part Number: STM32G431KBT6; Core: ARM Cortex-M4; Speed: 170 MHz; Created On: 22/05/2020 19:49:45; Updated On: 22/05/2020 19:55:34; Type: microcontroller; Package: LQFP32
Y1 = ABM8W-24.0000MHZ-8-B1U-T3: 24MHz 8pF -20C +70C 20ppm Crystal Oscillator; Manufacturer: ABRACON; Frquency Tolerance: 10 ppm; Through Hole: 0; Part Number: ABM8W-24.0000MHZ-8-B1U-T3; Value: 24 MHz; Load Capacitance: 8 pF; Frequency: 24 MHz; Created On: 24/05/2020 8:58:56; Updated On: 26/05/2020 19:01:38; Type: crystal_oscillator; Package: 4-SMD, No Lead

## Sheet Peripherals.SchDoc
size A4
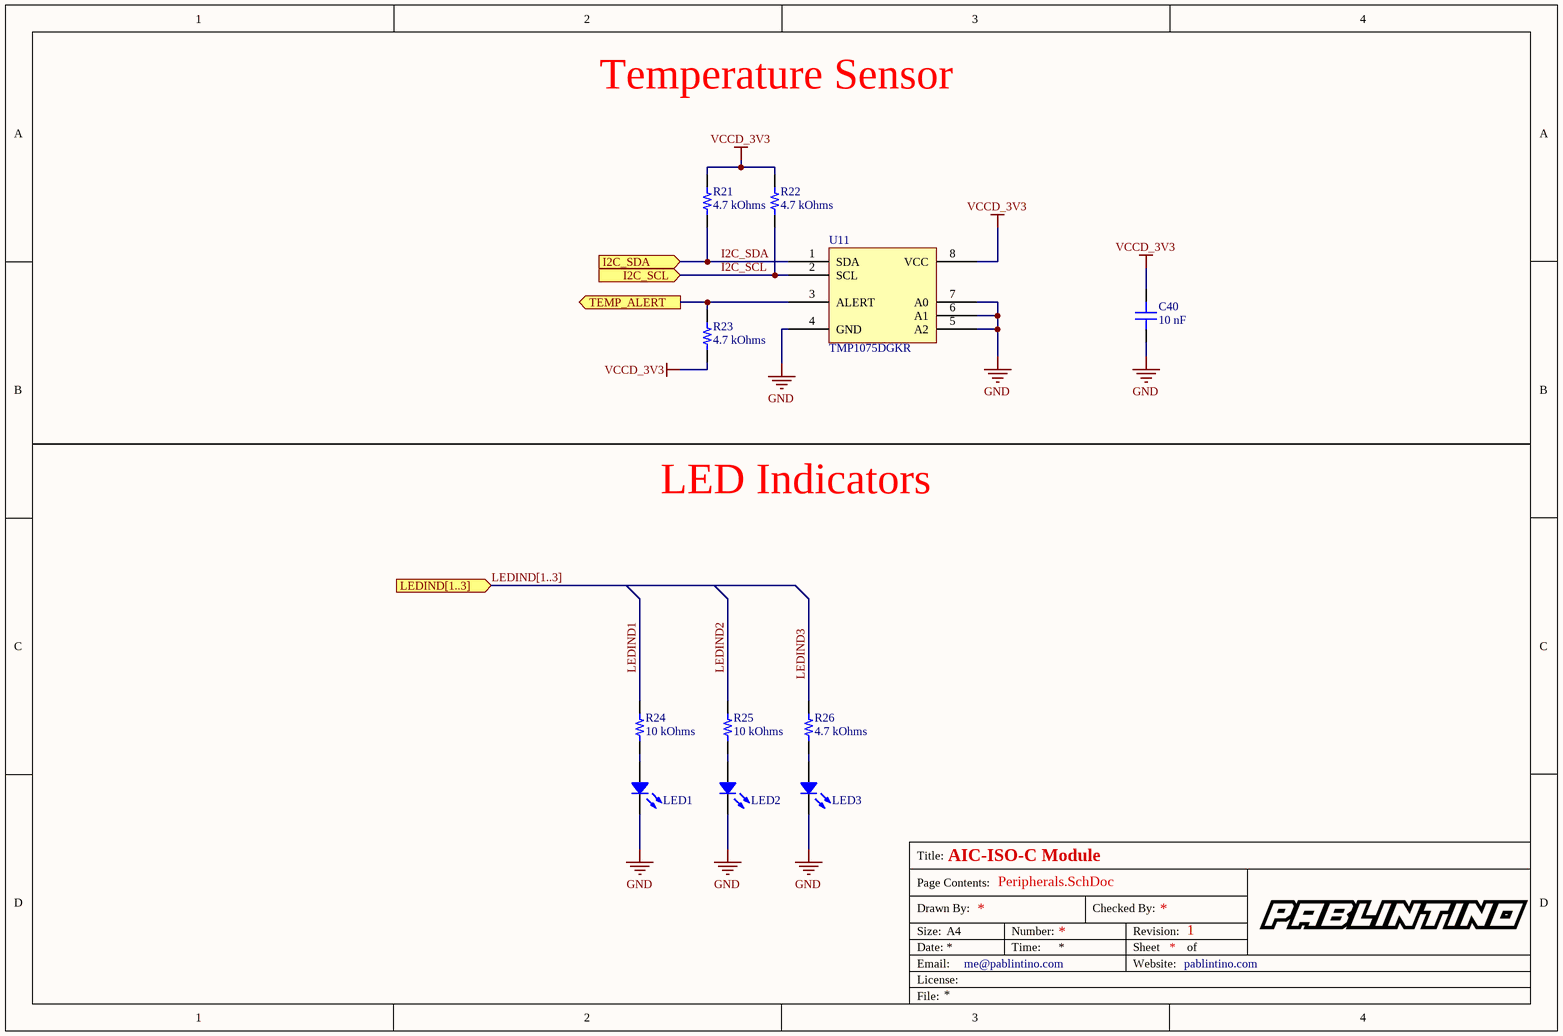
[diagram p5: Peripherals.SchDoc]

### Parts
C40  10 nF  [CAP 0603_1608]
LED1  APTD1608LZGCK  [LED 0603_1608 GREEN]  (value not drawn)
LED2  APTD1608LZGCK  [LED 0603_1608 GREEN]  (value not drawn)
LED3  APTD1608LSECK  [LED 0603_1608 RED]  (value not drawn)
R21  4.7 kOhms  [RES 0603_1608]
R22  4.7 kOhms  [RES 0603_1608]
R23  4.7 kOhms  [RES 0603_1608]
R24  10 kOhms  [RES 0603_1608]
R25  10 kOhms  [RES 0603_1608]
R26  4.7 kOhms  [RES 0603_1608]
U11  TMP1075DGKR  [TI VSSOP-8 DGK]

### Ports
I2C_SCL (in), I2C_SDA (in), LEDIND[1..3] (in), TEMP_ALERT (out)

### Nets
GND: C40.2 LED1.2 LED2.2 LED3.2 U11.4(GND) U11.5(A2) U11.6(A1) U11.7(A0)
VCCD_3V3: C40.1 R21.2 R22.2 R23.1 U11.8(VCC)
I2C_SCL: R22.1 U11.2(SCL) ; port I2C_SCL
I2C_SDA: R21.1 U11.1(SDA) ; port I2C_SDA
LEDIND1: R24.1
LEDIND2: R25.1
LEDIND3: R26.1
NetLED1_1: LED1.1 R24.2
NetLED2_1: LED2.1 R25.2
NetLED3_1: LED3.1 R26.2
NetR23_2: R23.2 U11.3(ALERT) ; port TEMP_ALERT

### Buses and harness runs
bus LEDIND[1..3] = port LEDIND[1..3]

### Notes on the sheet
- Temperature Sensor
- LED Indicators
- Title:
- Drawn By:
- Page Contents:
- Checked By:
- Size:
- Date:
- File:
- License:
- Email:
- A4
- Number:
- Time:
- Revision:
- Sheet
- Website:
- of

### Library data of the parts
C40 = 0603YC103JAT2A: MLCC Ceramic 10 nF 16 V 5% Capacitor; Manufacturer: AVX; Voltage: 16 V; Type: capacitor_ceramic; Through Hole: 0; Part Number: 0603YC103JAT2A; Value: 10 nF; Tolerance: 5%; Composition: X7R; Created On: 02/09/2020 21:50:45; Updated On: 02/09/2020 21:52:04; Package: 0603 (1608 Metric)
LED1 LED2 = APTD1608LZGCK: SMD Low Current Green LED; Manufacturer: Kingbright; Gain Bandwith Product: 2.65 V; Input Type: dome; Amplifier Type: clear; Slew Rate: 515 nm; Voltage Supplies: 2 mA; Input Offset Voltage: 0.8 mm x 1.2 mm; Type: led_indicator; Through Hole: 0; Part Number: APTD1608LZGCK; Output Type: green; Created On: 28/07/2020 18:40:12; Updated On: 28/07/2020 18:43:35; Package: 0603 (1608 Metric)
LED3 = APTD1608LSECK: as LED4 on sheet PowerModule; Part Number: APTD1608LSECK; Output Type: red; Created On: 28/07/2020 18:43:03; Updated On: 28/07/2020 18:43:38; Package: 0603 (1608 Metric)
R21-R23 R26 = CRCW06034K70FKEAC: Thin Film Resistor 4.7 kOhms 1%; Manufacturer: Vishay / Dale; Power Max: 100 mW; Through Hole: 0; Part Number: CRCW06034K70FKEAC; Value: 4.7 kOhms; Tolerance: 1%; Created On: 28/07/2020 21:42:19; Updated On: 28/07/2020 21:42:52; Type: resistor; Package: 0603 (1608 Metric)
R24 R25 = CRCW060310K0FKEAC: as R18 on sheet PowerModule; Part Number: CRCW060310K0FKEAC; Value: 10 kOhms; Tolerance: 1%; Created On: 22/07/2020 22:08:22; Updated On: 22/07/2020 22:09:01; Type: resistor; Package: 0603 (1608 Metric)
U11 = TMP1075DGKR: TMP1075 Temperature Sensor With I2C and SMBus Interface; Manufacturer: Texas Instruments; Proportional Gain: 0.0625 C; Supply Voltage: 1.7 V to 5.5 V; Through Hole: 0; Part Number: TMP1075DGKR; Input Magnitude: temperature; Output Type: I2C; Created On: 04/08/2020 19:51:22; Updated On: 04/08/2020 19:51:56; Type: transducer; Package: VSSOP-8

## Sheet AnalogReceiverModule.SchDoc: CAN Current Loop Module - Analog Receiver
size A4; Author: Pablo R Nava; DrawnBy: Pablo R Nava; Engineer: Pablo R Nava
Used 4 times, as channels ARM1, ARM2, ARM3, ARM4. Parts and nets are listed once, with the designators drawn on the sheet.
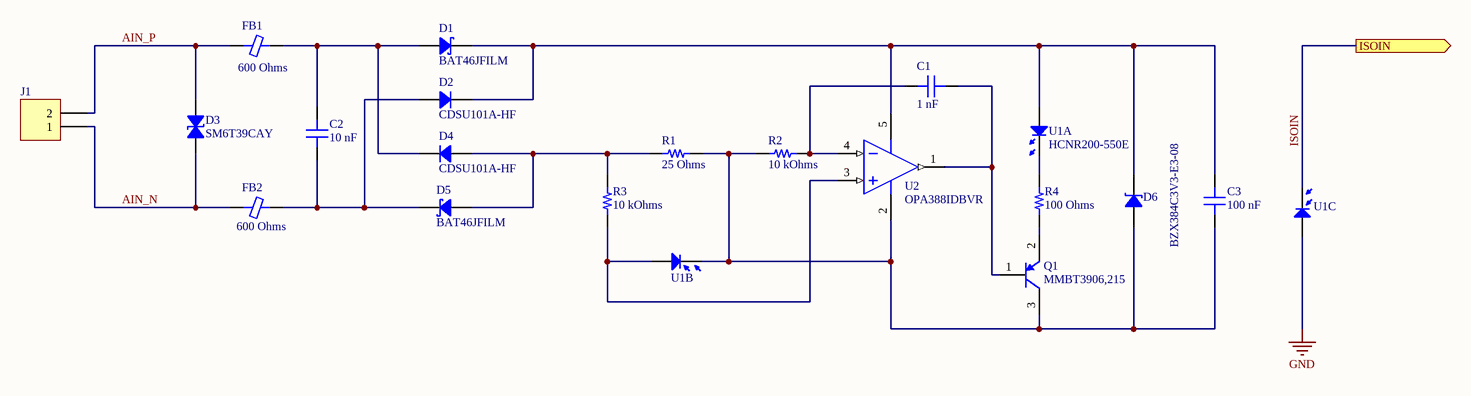
[diagram p6: AnalogReceiverModule.SchDoc]

### Parts
C1  1 nF  [CAP 0805_2012]
C2  10 nF  [CAP 0805_2012]
C3  100 nF  [CAP 0805_2012]
D1  BAT46JFILM  [SOD323]
D2  CDSU101A-HF  [SOD523F]
D3  SM6T39CAY  [DO214AA SMB]
D4  CDSU101A-HF  [SOD523F]
D5  BAT46JFILM  [SOD323]
D6  BZX384C3V3-E3-08  [SOD323]
FB1  600 Ohms  [FER 0805_2012]
FB2  600 Ohms  [FER 0805_2012]
J1  1757475  [MSTBA2]  (value not drawn)
Q1  MMBT3906,215  [NEXPERIA SOT-23-3]
R1  25 Ohms  [RES 0805_2012]
R2  10 kOhms  [RES 0805_2012]
R3  10 kOhms  [RES 0805_2012]
R4  100 Ohms  [RES 0805_2012]
U1  HCNR200-550E  [HCNR200]  (parts A,B,C of 3)
U2  OPA388IDBVR  [TI SOT-23-5 DBV]

### Ports
ISOIN (out)

### Nets
GND: U1.5(PD2_B)
AIN_N: D3.2 FB2.2 J1.1
AIN_P: D3.1 FB1.1 J1.2
ISOIN: U1.6(PD2_A) ; port ISOIN
NetC1_1: C1.1 Q1.1(B) U2.1(OUT)
NetC1_2: C1.2 R2.1 U2.4(IN-)
NetC2_1: C2.1 D2.1 D5.2 FB2.1
NetC2_2: C2.2 D1.1 D4.2 FB1.2
NetC3_1: C3.1 D6.1 Q1.3(C) R1.2 R2.2 U1.3(PD1_A) U2.2(GND)
NetC3_2: C3.2 D1.2 D2.2 D6.2 U1.2(LED_2) U2.5(VDD)
NetD4_1: D4.1 D5.1 R1.1 R3.1
NetQ1_2: Q1.2(E) R4.2
NetR3_2: R3.2 U1.4(PD1_B) U2.3(IN+)
NetR4_1: R4.1 U1.1(LED_1)

### Channels
ARM1: designators end in C1; ports ISOIN=ISOIN
ARM2: designators end in C2; ports ISOIN=ISOIN
ARM3: designators end in C3; ports ISOIN=ISOIN
ARM4: designators end in C4; ports ISOIN=ISOIN

### Notes on the sheet
- Title:
- Drawn By:
- Page Contents:
- Checked By:
- Size:
- Date:
- File:
- License:
- Email:
- A4
- Number:
- Time:
- Revision:
- Sheet
- Website:
- of

### Library data of the parts
C1 = C0805C102J2GECAUTO: MLCC Ceramic 1 nF 200 V 5% Capacitor; Manufacturer: KEMET; Voltage: 200 V; Type: capacitor_ceramic; Through Hole: 0; Part Number: C0805C102J2GECAUTO; Value: 1 nF; Tolerance: 5%; Composition: NP0; Created On: 30/05/2020 9:42:16; Updated On: 30/05/2020 9:42:22; Package: 0805 (2012 Metric)
C2 = C0805C103K5GEC7210: MLCC Ceramic 10 nF 50 V 10% Capacitor; Manufacturer: KEMET; Voltage: 50 V; Type: capacitor_ceramic; Through Hole: 0; Part Number: C0805C103K5GEC7210; Value: 10 nF; Tolerance: 10%; Composition: NP0; Created On: 28/05/2020 20:55:06; Updated On: 28/05/2020 20:58:59; Package: 0805 (2012 Metric)
C3 = 08055C104K4Z2A: as C18 on sheet PowerModule; Part Number: 08055C104K4Z2A; Value: 100 nF; Tolerance: 10%; Composition: X7R; Created On: 30/05/2020 9:36:24; Updated On: 30/05/2020 9:36:39; Package: 0805 (2012 Metric)
D1 D5 = BAT46JFILM: Schottky Diode; Manufacturer: STMicroelectronics; Forward Voltage: 0.45 V; Reverse Leakage Current: 5 uA; Maximum Forward Avg. Current: 150 mA; Maximum Repetitive Reverse Voltage: 100 V; Type: diode_rectifier; Through Hole: 0; Part Number: BAT46JFILM; Diode Type: schottky; Created On: 16/05/2020 11:52:41; Updated On: 16/05/2020 14:59:23; Package: SOD-323
D2 D4 = CDSU101A-HF: General Purpose Diode; Manufacturer: Comchip Technology; Forward Voltage: 1 V; Reverse Leakage Current: 50 nA; Maximum Forward Avg. Current: 100 mA; Maximum Repetitive Reverse Voltage: 90 V; Diode Type: rectifier; Type: diode_rectifier; Through Hole: 0; Part Number: CDSU101A-HF; Created On: 16/05/2020 11:56:11; Updated On: 16/05/2020 15:37:54; Package: SOD-523F
D3 = SM6T39CAY: TVS Diode; Manufacturer: STMicroelectronics; Standoff Reverse Voltage: 33.3 V; Minimum Breakdown Voltage: 39 V; Maximum Clamping Voltage: 53.9 V; Type: diode_tvs; Through Hole: 0; Part Number: SM6T39CAY; Created On: 16/05/2020 11:52:32; Updated On: 16/05/2020 15:46:11; Package: DO-214AA-2
D6 = BZX384C3V3-E3-08: Zener Diode 3.3 V 200 mW; Manufacturer: Vishay; Tolerance: 5%; Maximum Power: 200 mW; Forward Voltage: 0.6 V; Zener Voltage: 3.3 nA; Type: diode_zener; Through Hole: 0; Part Number: BZX384C3V3-E3-08; Created On: 16/05/2020 22:26:20; Updated On: 16/05/2020 22:36:30; Package: SOD-323-2
FB1 FB2 = BLM21SP601SH1D: as FB3 on sheet CPU; Part Number: BLM21SP601SH1D; Value: 600 Ohms; Created On: 16/05/2020 11:32:40; Updated On: 16/05/2020 17:15:58; Package: 0805 (2012 Metric)
J1 = 1757475: as J3 on sheet PowerModule; LatestRevisionDate: 17-Jul-2002; LatestRevisionNote: Re-released for DXP Platform.; Publisher: Altium Limited; Part Number: 1757475; Orientation: right; Pitch: 5 mm; Number of Rows: 1; Created On: 18/07/2020 15:45:14; Updated On: 18/07/2020 15:45:51; Type: connector_pcb; Package: Through Hole
Q1 = MMBT3906,215: PNP BJT Switching transistor; Manufacturer: Nexperia; Collector Emiter Saturation Voltage: 250 mW; hfe Gain: 300; Collector Emiter Max. Votage: 40 V; Collector Max. Current: 200 mA; Type: transistor_bjt; Through Hole: 0; Part Number: MMBT3906,215; Maximum Power: 250 mW; BJT Type: PNP; Created On: 17/05/2020 17:12:55; Updated On: 17/05/2020 18:19:58; Package: SOT-23
R1 = PAT0805E25R0BST1: Thin Film Resistor 25 Ohms 0.1%; Manufacturer: Vishay; Power Max: 200 mW; Through Hole: 0; Part Number: PAT0805E25R0BST1; Value: 25 Ohms; Tolerance: 0.1%; Created On: 16/05/2020 11:40:45; Updated On: 16/05/2020 13:13:11; Type: resistor; Package: 0805 (2012 Metric)
R2 R3 = CRCW080510K0FKEAC: Thin Film Resistor 10 kOhms 1%; Manufacturer: Vishay / Dale; Power Max: 125 mW; Through Hole: 0; Part Number: CRCW080510K0FKEAC; Value: 10 kOhms; Tolerance: 1%; Created On: 16/05/2020 11:50:43; Updated On: 16/05/2020 13:13:15; Type: resistor; Package: 0805 (2012 Metric)
R4 = CRCW0805100RFKEAC: Thin Film Resistor 100 Ohms 1%; Manufacturer: Vishay / Dale; Power Max: 125 mW; Through Hole: 0; Part Number: CRCW0805100RFKEAC; Value: 100 Ohms; Tolerance: 1%; Created On: 16/05/2020 11:51:25; Updated On: 16/05/2020 13:13:19; Type: resistor; Package: 0805 (2012 Metric)
U1 = HCNR200-550E: HCNR200 High-Linearity Analog Optocoupler; Manufacturer: Broadcom / Avago; Isolation Voltage: 1414 V; Transfer Gain: 1.00; Input FOrward Voltage: 1.6 V; Servo Gain: 0.5; Non Linearity: 0.01%; Through Hole: 0; Part Number: HCNR200-550E; Forward Gain: 0.5; Created On: 17/05/2020 9:43:12; Updated On: 17/05/2020 9:47:26; Type: optocoupler_linear; Package: DIP-8 Gull Wing
U2 = OPA388IDBVR: OPA388 Zero-Drift, Zero-Crossover, Low Offset, Precision Rail-to-Rail I/O Opamp; Manufacturer: Texas Instruments; Gain Bandwith Product: 10 MHz; Slew Rate: 5 V/us; Voltage Supplies: ±1.25 V to ±2.75 V; Input Offset Voltage: 0.25 uV; Output Current: ±30 mA; Through Hole: 0; Part Number: OPA388IDBVR; Output Type: Rail-to-Rail; Input Type: Rail-to-Rail; Amplifier Type: precision; Created On: 19/08/2020 23:52:36; Updated On: 19/08/2020 23:57:00; Type: opamp; Package: TSSOP-14

## Nets that join several sheets
GND: PowerModule (20 pins), AnalogueIsolatedReceiver (6 pins), CanTransceiver (C35.2 C36.2 U10.2 U10.8), CPU (17 pins), Peripherals (8 pins), ARM1 (U1C1.5), ARM2 (U1C2.5), ARM3 (U1C3.5), ARM4 (U1C4.5)
GND_ISO: PowerModule (6 pins), CanTransceiver (11 pins)
VCC_5_ISO: PowerModule (C27.1 C28.1 U7.5), CanTransceiver (C33.2 C34.1 U10.11 U10.16)
VCCA_3V3: PowerModule (C32.1 U9.5), AnalogueIsolatedReceiver (C4.2 U3.4), CPU (C11.1 FB3.2)
VCCD_3V3: PowerModule (C30.1 U8.5), CanTransceiver (C35.1 C36.1 U10.1), CPU (8 pins), Peripherals (5 pins)
AICHN1: AnalogueIsolatedReceiver (C5.2 R6.2 R6.3 U3.1), CPU (U4.8)
AICHN2: AnalogueIsolatedReceiver (C6.2 R8.2 R8.3 U3.7), CPU (U4.7)
AICHN3: AnalogueIsolatedReceiver (C7.2 R10.2 R10.3 U3.8), CPU (U4.6)
AICHN4: AnalogueIsolatedReceiver (C8.2 R12.2 R12.3 U3.14), CPU (U4.5)
CAN_RXD: CanTransceiver (U10.5), CPU (U4.21)
CAN_TXD: CanTransceiver (U10.3), CPU (U4.22)
I2C_SCL: CPU (U4.18), Peripherals (R22.1 U11.2)
I2C_SDA: CPU (U4.28), Peripherals (R21.1 U11.1)
ISOIN: AnalogueIsolatedReceiver (C5.1 R5.2 U3.2), ARM1 (U1C1.6)
ISOIN: AnalogueIsolatedReceiver (C6.1 R7.2 U3.6), ARM2 (U1C2.6)
ISOIN: AnalogueIsolatedReceiver (C7.1 R9.2 U3.9), ARM3 (U1C3.6)
ISOIN: AnalogueIsolatedReceiver (C8.1 R11.2 U3.13), ARM4 (U1C4.6)
LEDIND1: CPU (U4.9), Peripherals (R24.1)
LEDIND2: CPU (U4.10), Peripherals (R25.1)
LEDIND3: CPU (U4.11), Peripherals (R26.1)
NetR23_2: CPU (U4.12), Peripherals (R23.2 U11.3)